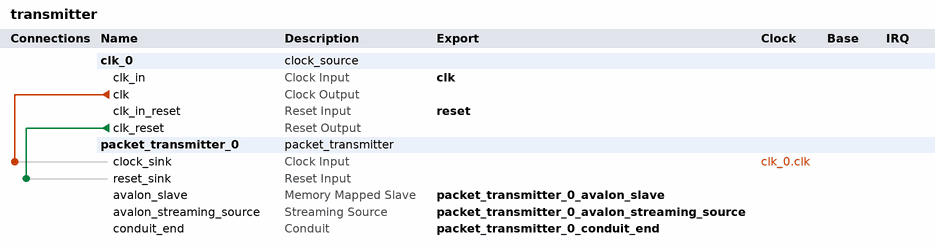
[diagram p0: system contents]
# Platform Designer (Qsys) system transmitter, Cyclone V 5CEBA4U19C8
# Parameters at their usual value, and those the tool derives, are not listed.
package require -exact qsys 13.0
create_system transmitter
set_project_property DEVICE_FAMILY {Cyclone V}
set_project_property DEVICE 5CEBA4U19C8

add_instance clk_0 clock_source 13.0
set_instance_parameter_value clk_0 clockFrequency 125000000

add_instance packet_transmitter_0 packet_transmitter 1.0
set_instance_parameter_value packet_transmitter_0 HEADERLEN 48
set_instance_parameter_value packet_transmitter_0 TIMEIN_WIDTH 32

# connections
add_connection clk_0.clk packet_transmitter_0.clock_sink clock
add_connection clk_0.clk_reset packet_transmitter_0.reset_sink reset

# exported interfaces
add_interface clk clock sink
set_interface_property clk EXPORT_OF clk_0.clk_in
add_interface reset reset sink
set_interface_property reset EXPORT_OF clk_0.clk_in_reset
add_interface packet_transmitter_0_avalon_slave avalon slave
set_interface_property packet_transmitter_0_avalon_slave EXPORT_OF packet_transmitter_0.avalon_slave
add_interface packet_transmitter_0_conduit_end conduit end
set_interface_property packet_transmitter_0_conduit_end EXPORT_OF packet_transmitter_0.conduit_end
add_interface packet_transmitter_0_avalon_streaming_source avalon_streaming source
set_interface_property packet_transmitter_0_avalon_streaming_source EXPORT_OF packet_transmitter_0.avalon_streaming_source

set_interconnect_requirement {$system} qsys_mm.clockCrossingAdapter HANDSHAKE
set_interconnect_requirement {$system} qsys_mm.maxAdditionalLatency 1

save_system transmitter.qsys
